# EAGLE schematic AD1938-breakout (EAGLE 9.4.0)
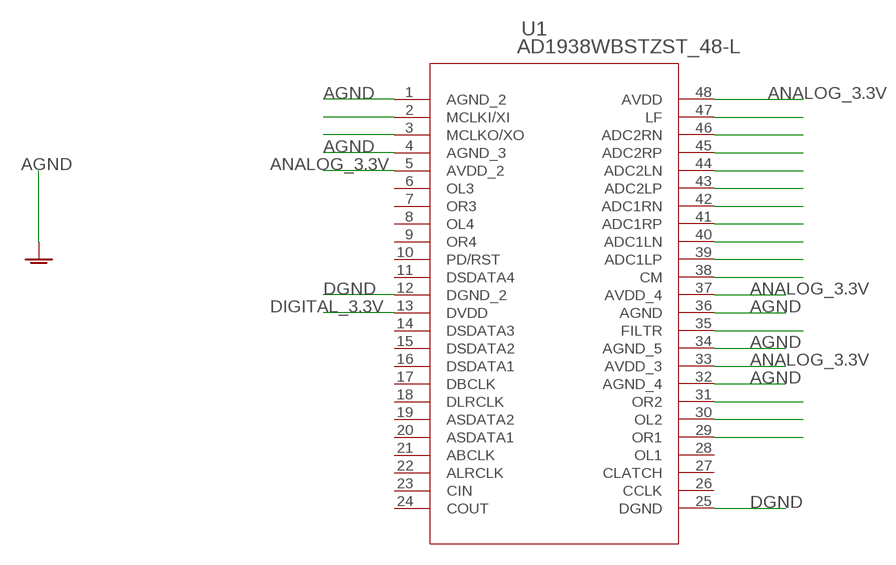
[diagram p0: schematic, sheet 1]

## Parts
U1  AD1938WBSTZST_48-L  [ST_48-L]

## Nets
AGND: U1.1(AGND_2) U1.4(AGND_3) U1.32(AGND_4) U1.34(AGND_5) U1.36(AGND)
ANALOG_3.3V: U1.5(AVDD_2) U1.33(AVDD_3) U1.37(AVDD_4) U1.48(AVDD)
DGND: U1.12(DGND_2) U1.25(DGND)
DIGITAL_3.3V: U1.13(DVDD)
N$1: U1.47(LF)
N$2: U1.46(ADC2RN)
N$3: U1.2(MCLKI/XI)
N$4: U1.3(MCLKO/XO)
N$5: U1.45(ADC2RP)
N$6: U1.44(ADC2LN)
N$7: U1.43(ADC2LP)
N$8: U1.42(ADC1RN)
N$9: U1.41(ADC1RP)
N$10: U1.40(ADC1LN)
N$11: U1.39(ADC1LP)
N$12: U1.38(CM)
N$13: U1.35(FILTR)
N$14: U1.31(OR2)
N$15: U1.30(OL2)
N$16: U1.29(OR1)
Unconnected: U1.6(OL3) U1.7(OR3) U1.8(OL4) U1.9(OR4) U1.10(PD/RST) U1.11(DSDATA4) U1.14(DSDATA3) U1.15(DSDATA2) U1.16(DSDATA1) U1.17(DBCLK) U1.18(DLRCLK) U1.19(ASDATA2) U1.20(ASDATA1) U1.21(ABCLK) U1.22(ALRCLK) U1.23(CIN) U1.24(COUT) U1.26(CCLK) U1.27(CLATCH) U1.28(OL1)

## Library data of the parts
U1 = 0000-master:AD1938WBSTZ; MANUFACTURER_PART_NUMBER: AD1938WBSTZ; VENDOR: Analog Devices Inc